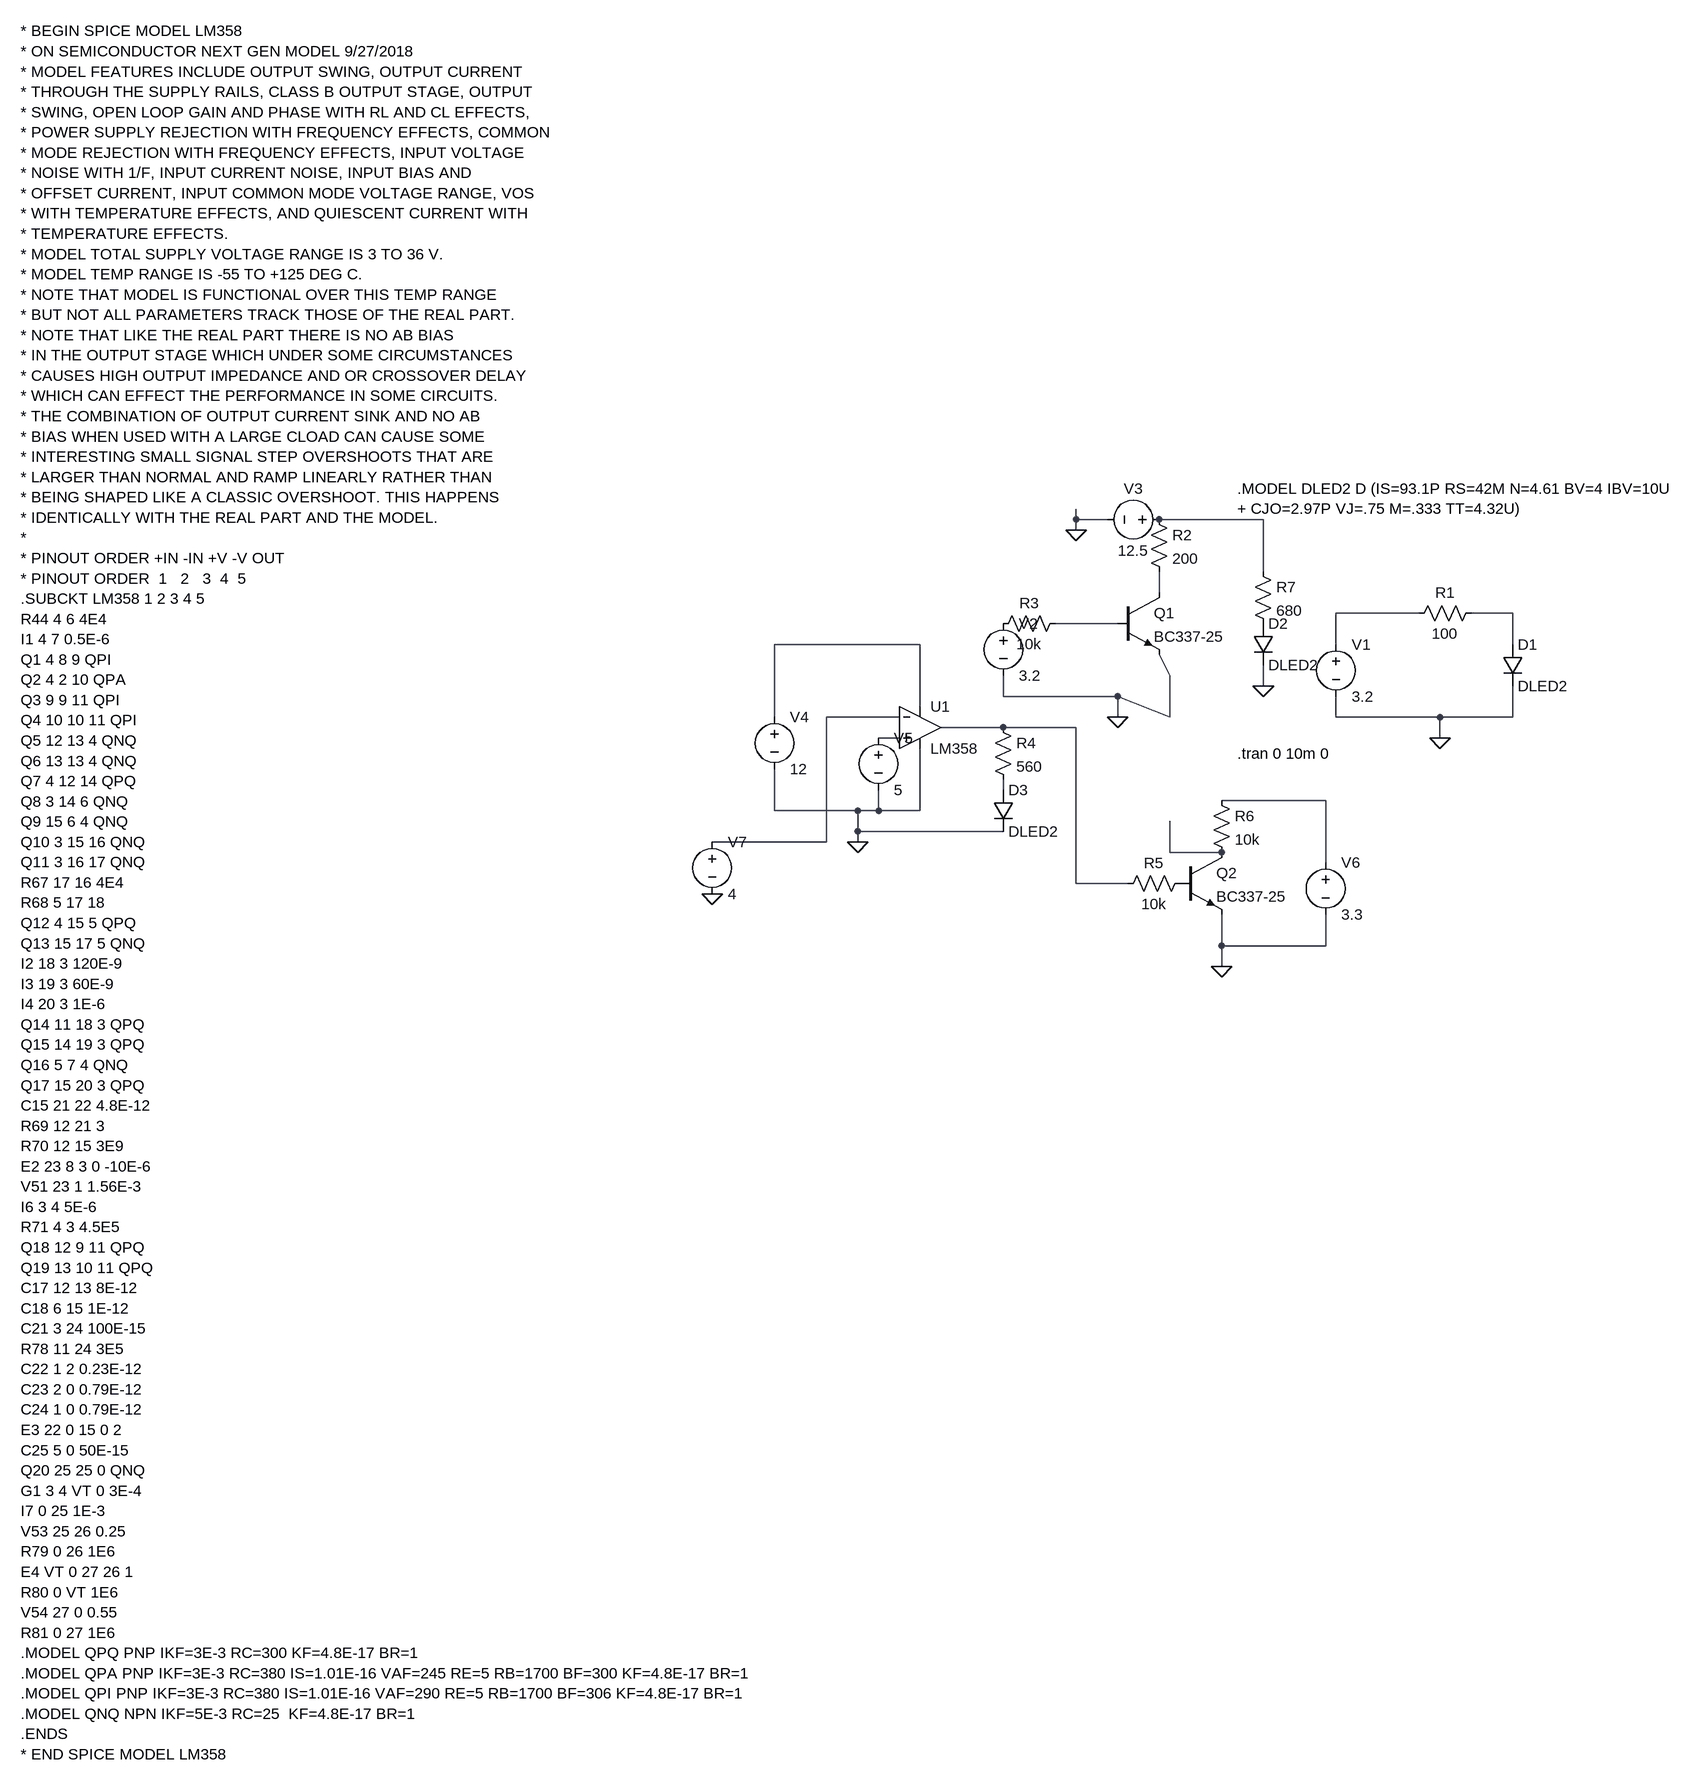
[diagram p0: schematic Draft1.asc]
Draft1.asc, the LTspice schematic file:
Version 4
SHEET 1 880 1612
WIRE -368 -32 -368 -48
WIRE -320 -32 -368 -32
WIRE -80 -32 -240 -32
WIRE -368 -16 -368 -32
WIRE -80 48 -80 -32
WIRE -240 80 -240 48
WIRE 160 112 32 112
WIRE 304 112 240 112
WIRE -304 128 -400 128
WIRE -608 160 -832 160
WIRE 32 160 32 112
WIRE 304 160 304 112
WIRE -224 208 -240 176
WIRE -80 224 -80 192
WIRE -480 240 -480 208
WIRE -304 240 -480 240
WIRE -608 256 -608 160
WIRE -832 272 -832 160
WIRE -640 272 -752 272
WIRE -304 272 -304 240
WIRE -224 272 -224 208
WIRE -224 272 -304 240
WIRE 32 272 32 240
WIRE 192 272 32 272
WIRE 304 272 304 224
WIRE 304 272 192 272
WIRE -480 288 -576 288
WIRE -368 288 -480 288
WIRE -640 304 -672 304
WIRE 192 304 192 272
WIRE -480 384 -480 368
WIRE 16 400 -144 400
WIRE -832 416 -832 352
WIRE -704 416 -832 416
WIRE -672 416 -672 384
WIRE -672 416 -704 416
WIRE -608 416 -608 320
WIRE -608 416 -672 416
WIRE -704 448 -704 416
WIRE -480 448 -704 448
WIRE -752 464 -752 272
WIRE -752 464 -928 464
WIRE -704 464 -704 448
WIRE -224 480 -224 432
WIRE -144 480 -224 480
WIRE 16 496 16 400
WIRE -368 528 -368 288
WIRE -288 528 -368 528
WIRE -144 624 -144 576
WIRE 16 624 16 576
WIRE 16 624 -144 624
WIRE -144 656 -144 624
FLAG 192 304 0
FLAG -304 272 0
FLAG -368 -16 0
FLAG -704 464 0
FLAG -144 656 0
FLAG -928 544 0
FLAG -80 224 0
SYMBOL voltage 32 144 R0
WINDOW 123 0 0 Left 0
WINDOW 39 0 0 Left 0
SYMATTR InstName V1
SYMATTR Value 3.2
SYMBOL res 256 96 R90
WINDOW 0 0 56 VBottom 2
WINDOW 3 32 56 VTop 2
SYMATTR InstName R1
SYMATTR Value 100
SYMBOL diode 288 160 R0
SYMATTR InstName D1
SYMATTR Value DLED2
SYMBOL npn -304 80 R0
SYMATTR InstName Q1
SYMATTR Value BC337-25
SYMBOL voltage -480 112 R0
WINDOW 123 0 0 Left 0
WINDOW 39 0 0 Left 0
SYMATTR InstName V2
SYMATTR Value 3.2
SYMBOL res -256 -48 R0
SYMATTR InstName R2
SYMATTR Value 200
SYMBOL res -384 112 R90
WINDOW 0 0 56 VBottom 2
WINDOW 3 32 56 VTop 2
SYMATTR InstName R3
SYMATTR Value 10k
SYMBOL voltage -224 -32 R90
WINDOW 0 -32 56 VBottom 2
WINDOW 3 32 56 VTop 2
WINDOW 123 0 0 Left 0
WINDOW 39 0 0 Left 0
SYMATTR InstName V3
SYMATTR Value 12.5
SYMBOL Opamps\\opamp2 -608 224 R0
SYMATTR InstName U1
SYMATTR Value LM358
SYMBOL voltage -832 256 R0
WINDOW 123 0 0 Left 0
WINDOW 39 0 0 Left 0
SYMATTR InstName V4
SYMATTR Value 12
SYMBOL res -496 272 R0
SYMATTR InstName R4
SYMATTR Value 560
SYMBOL diode -496 384 R0
SYMATTR InstName D3
SYMATTR Value DLED2
SYMBOL voltage -672 288 R0
WINDOW 123 0 0 Left 0
WINDOW 39 0 0 Left 0
SYMATTR InstName V5
SYMATTR Value 5
SYMBOL npn -208 480 R0
SYMATTR InstName Q2
SYMATTR Value BC337-25
SYMBOL res -192 512 R90
WINDOW 0 0 56 VBottom 2
WINDOW 3 32 56 VTop 2
SYMATTR InstName R5
SYMATTR Value 10k
SYMBOL voltage 16 480 R0
WINDOW 123 0 0 Left 0
WINDOW 39 0 0 Left 0
SYMATTR InstName V6
SYMATTR Value 3.3
SYMBOL res -160 384 R0
SYMATTR InstName R6
SYMATTR Value 10k
SYMBOL voltage -928 448 R0
WINDOW 123 0 0 Left 0
WINDOW 39 0 0 Left 0
SYMATTR InstName V7
SYMATTR Value 4
SYMBOL res -96 32 R0
SYMATTR InstName R7
SYMATTR Value 680
SYMBOL diode -96 128 R0
SYMATTR InstName D2
SYMATTR Value DLED2
TEXT -120 -80 Left 2 !.MODEL DLED2 D (IS=93.1P RS=42M N=4.61 BV=4 IBV=10U\n+ CJO=2.97P VJ=.75 M=.333 TT=4.32U)
TEXT -120 328 Left 2 !.tran 0 10m 0
TEXT -1992 -784 Left 2 !* BEGIN SPICE MODEL LM358\n* ON SEMICONDUCTOR NEXT GEN MODEL 9/27/2018\n* MODEL FEATURES INCLUDE OUTPUT SWING, OUTPUT CURRENT\n* THROUGH THE SUPPLY RAILS, CLASS B OUTPUT STAGE, OUTPUT\n* SWING, OPEN LOOP GAIN AND PHASE WITH RL AND CL EFFECTS,\n* POWER SUPPLY REJECTION WITH FREQUENCY EFFECTS, COMMON\n* MODE REJECTION WITH FREQUENCY EFFECTS, INPUT VOLTAGE\n* NOISE WITH 1/F, INPUT CURRENT NOISE, INPUT BIAS AND\n* OFFSET CURRENT, INPUT COMMON MODE VOLTAGE RANGE, VOS\n* WITH TEMPERATURE EFFECTS, AND QUIESCENT CURRENT WITH\n* TEMPERATURE EFFECTS.\n* MODEL TOTAL SUPPLY VOLTAGE RANGE IS 3 TO 36 V.\n* MODEL TEMP RANGE IS -55 TO +125 DEG C.\n* NOTE THAT MODEL IS FUNCTIONAL OVER THIS TEMP RANGE\n* BUT NOT ALL PARAMETERS TRACK THOSE OF THE REAL PART.\n* NOTE THAT LIKE THE REAL PART THERE IS NO AB BIAS\n* IN THE OUTPUT STAGE WHICH UNDER SOME CIRCUMSTANCES\n* CAUSES HIGH OUTPUT IMPEDANCE AND OR CROSSOVER DELAY\n* WHICH CAN EFFECT THE PERFORMANCE IN SOME CIRCUITS.\n* THE COMBINATION OF OUTPUT CURRENT SINK AND NO AB\n* BIAS WHEN USED WITH A LARGE CLOAD CAN CAUSE SOME\n* INTERESTING SMALL SIGNAL STEP OVERSHOOTS THAT ARE\n* LARGER THAN NORMAL AND RAMP LINEARLY RATHER THAN\n* BEING SHAPED LIKE A CLASSIC OVERSHOOT. THIS HAPPENS\n* IDENTICALLY WITH THE REAL PART AND THE MODEL.\n*\n* PINOUT ORDER +IN -IN +V -V OUT\n* PINOUT ORDER  1   2   3  4  5\n.SUBCKT LM358 1 2 3 4 5\nR44 4 6 4E4\nI1 4 7 0.5E-6\nQ1 4 8 9 QPI\nQ2 4 2 10 QPA\nQ3 9 9 11 QPI\nQ4 10 10 11 QPI\nQ5 12 13 4 QNQ\nQ6 13 13 4 QNQ\nQ7 4 12 14 QPQ\nQ8 3 14 6 QNQ\nQ9 15 6 4 QNQ\nQ10 3 15 16 QNQ\nQ11 3 16 17 QNQ\nR67 17 16 4E4\nR68 5 17 18\nQ12 4 15 5 QPQ\nQ13 15 17 5 QNQ\nI2 18 3 120E-9\nI3 19 3 60E-9\nI4 20 3 1E-6\nQ14 11 18 3 QPQ\nQ15 14 19 3 QPQ\nQ16 5 7 4 QNQ\nQ17 15 20 3 QPQ\nC15 21 22 4.8E-12\nR69 12 21 3\nR70 12 15 3E9\nE2 23 8 3 0 -10E-6\nV51 23 1 1.56E-3\nI6 3 4 5E-6\nR71 4 3 4.5E5\nQ18 12 9 11 QPQ\nQ19 13 10 11 QPQ\nC17 12 13 8E-12\nC18 6 15 1E-12\nC21 3 24 100E-15\nR78 11 24 3E5\nC22 1 2 0.23E-12\nC23 2 0 0.79E-12\nC24 1 0 0.79E-12\nE3 22 0 15 0 2\nC25 5 0 50E-15\nQ20 25 25 0 QNQ\nG1 3 4 VT 0 3E-4\nI7 0 25 1E-3\nV53 25 26 0.25\nR79 0 26 1E6\nE4 VT 0 27 26 1\nR80 0 VT 1E6\nV54 27 0 0.55\nR81 0 27 1E6\n.MODEL QPQ PNP IKF=3E-3 RC=300 KF=4.8E-17 BR=1\n.MODEL QPA PNP IKF=3E-3 RC=380 IS=1.01E-16 VAF=245 RE=5 RB=1700 BF=300 KF=4.8E-17 BR=1\n.MODEL QPI PNP IKF=3E-3 RC=380 IS=1.01E-16 VAF=290 RE=5 RB=1700 BF=306 KF=4.8E-17 BR=1\n.MODEL QNQ NPN IKF=5E-3 RC=25  KF=4.8E-17 BR=1\n.ENDS\n* END SPICE MODEL LM358

The netlist it stands for:
* Draft1.asc
V1 N003 0 3.2
R1 N004 N003 100
D1 N004 0 DLED2
Q1 N002 N005 0 0 BC337-25
V2 P001 0 3.2
R2 N001 N002 200
R3 N005 P001 10k
V3 N001 0 12.5
XU1 N009 N007 N006 0 N008 LM358  ; pins In+ In- V+ V- OUT
V4 N006 0 12
R4 N008 N010 560
D3 N010 0 DLED2
V5 N009 0 5
Q2 N012 P002 0 0 BC337-25
R5 P002 N008 10k
V6 N011 0 3.3
R6 N011 N012 10k
V7 N007 0 4
R7 N001 P003 680
D2 P003 0 DLED2
.model D D
.lib standard.dio
.model NPN NPN
.model PNP PNP
.lib standard.bjt
.MODEL DLED2 D (IS=93.1P RS=42M N=4.61 BV=4 IBV=10U
+ CJO=2.97P VJ=.75 M=.333 TT=4.32U)
.tran 0 10m 0
* BEGIN SPICE MODEL LM358
* ON SEMICONDUCTOR NEXT GEN MODEL 9/27/2018
* MODEL FEATURES INCLUDE OUTPUT SWING, OUTPUT CURRENT
* THROUGH THE SUPPLY RAILS, CLASS B OUTPUT STAGE, OUTPUT
* SWING, OPEN LOOP GAIN AND PHASE WITH RL AND CL EFFECTS,
* POWER SUPPLY REJECTION WITH FREQUENCY EFFECTS, COMMON
* MODE REJECTION WITH FREQUENCY EFFECTS, INPUT VOLTAGE
* NOISE WITH 1/F, INPUT CURRENT NOISE, INPUT BIAS AND
* OFFSET CURRENT, INPUT COMMON MODE VOLTAGE RANGE, VOS
* WITH TEMPERATURE EFFECTS, AND QUIESCENT CURRENT WITH
* TEMPERATURE EFFECTS.
* MODEL TOTAL SUPPLY VOLTAGE RANGE IS 3 TO 36 V.
* MODEL TEMP RANGE IS -55 TO +125 DEG C.
* NOTE THAT MODEL IS FUNCTIONAL OVER THIS TEMP RANGE
* BUT NOT ALL PARAMETERS TRACK THOSE OF THE REAL PART.
* NOTE THAT LIKE THE REAL PART THERE IS NO AB BIAS
* IN THE OUTPUT STAGE WHICH UNDER SOME CIRCUMSTANCES
* CAUSES HIGH OUTPUT IMPEDANCE AND OR CROSSOVER DELAY
* WHICH CAN EFFECT THE PERFORMANCE IN SOME CIRCUITS.
* THE COMBINATION OF OUTPUT CURRENT SINK AND NO AB
* BIAS WHEN USED WITH A LARGE CLOAD CAN CAUSE SOME
* INTERESTING SMALL SIGNAL STEP OVERSHOOTS THAT ARE
* LARGER THAN NORMAL AND RAMP LINEARLY RATHER THAN
* BEING SHAPED LIKE A CLASSIC OVERSHOOT. THIS HAPPENS
* IDENTICALLY WITH THE REAL PART AND THE MODEL.
*
* PINOUT ORDER +IN -IN +V -V OUT
* PINOUT ORDER  1   2   3  4  5
.SUBCKT LM358 1 2 3 4 5
R44 4 6 4E4
I1 4 7 0.5E-6
Q1 4 8 9 QPI
Q2 4 2 10 QPA
Q3 9 9 11 QPI
Q4 10 10 11 QPI
Q5 12 13 4 QNQ
Q6 13 13 4 QNQ
Q7 4 12 14 QPQ
Q8 3 14 6 QNQ
Q9 15 6 4 QNQ
Q10 3 15 16 QNQ
Q11 3 16 17 QNQ
R67 17 16 4E4
R68 5 17 18
Q12 4 15 5 QPQ
Q13 15 17 5 QNQ
I2 18 3 120E-9
I3 19 3 60E-9
I4 20 3 1E-6
Q14 11 18 3 QPQ
Q15 14 19 3 QPQ
Q16 5 7 4 QNQ
Q17 15 20 3 QPQ
C15 21 22 4.8E-12
R69 12 21 3
R70 12 15 3E9
E2 23 8 3 0 -10E-6
V51 23 1 1.56E-3
I6 3 4 5E-6
R71 4 3 4.5E5
Q18 12 9 11 QPQ
Q19 13 10 11 QPQ
C17 12 13 8E-12
C18 6 15 1E-12
C21 3 24 100E-15
R78 11 24 3E5
C22 1 2 0.23E-12
C23 2 0 0.79E-12
C24 1 0 0.79E-12
E3 22 0 15 0 2
C25 5 0 50E-15
Q20 25 25 0 QNQ
G1 3 4 VT 0 3E-4
I7 0 25 1E-3
V53 25 26 0.25
R79 0 26 1E6
E4 VT 0 27 26 1
R80 0 VT 1E6
V54 27 0 0.55
R81 0 27 1E6
.MODEL QPQ PNP IKF=3E-3 RC=300 KF=4.8E-17 BR=1
.MODEL QPA PNP IKF=3E-3 RC=380 IS=1.01E-16 VAF=245 RE=5 RB=1700 BF=300 KF=4.8E-17 BR=1
.MODEL QPI PNP IKF=3E-3 RC=380 IS=1.01E-16 VAF=290 RE=5 RB=1700 BF=306 KF=4.8E-17 BR=1
.MODEL QNQ NPN IKF=5E-3 RC=25  KF=4.8E-17 BR=1
.ENDS
* END SPICE MODEL LM358
.backanno
.end